# Altium schematic sheet Processor.SchDoc
size A3
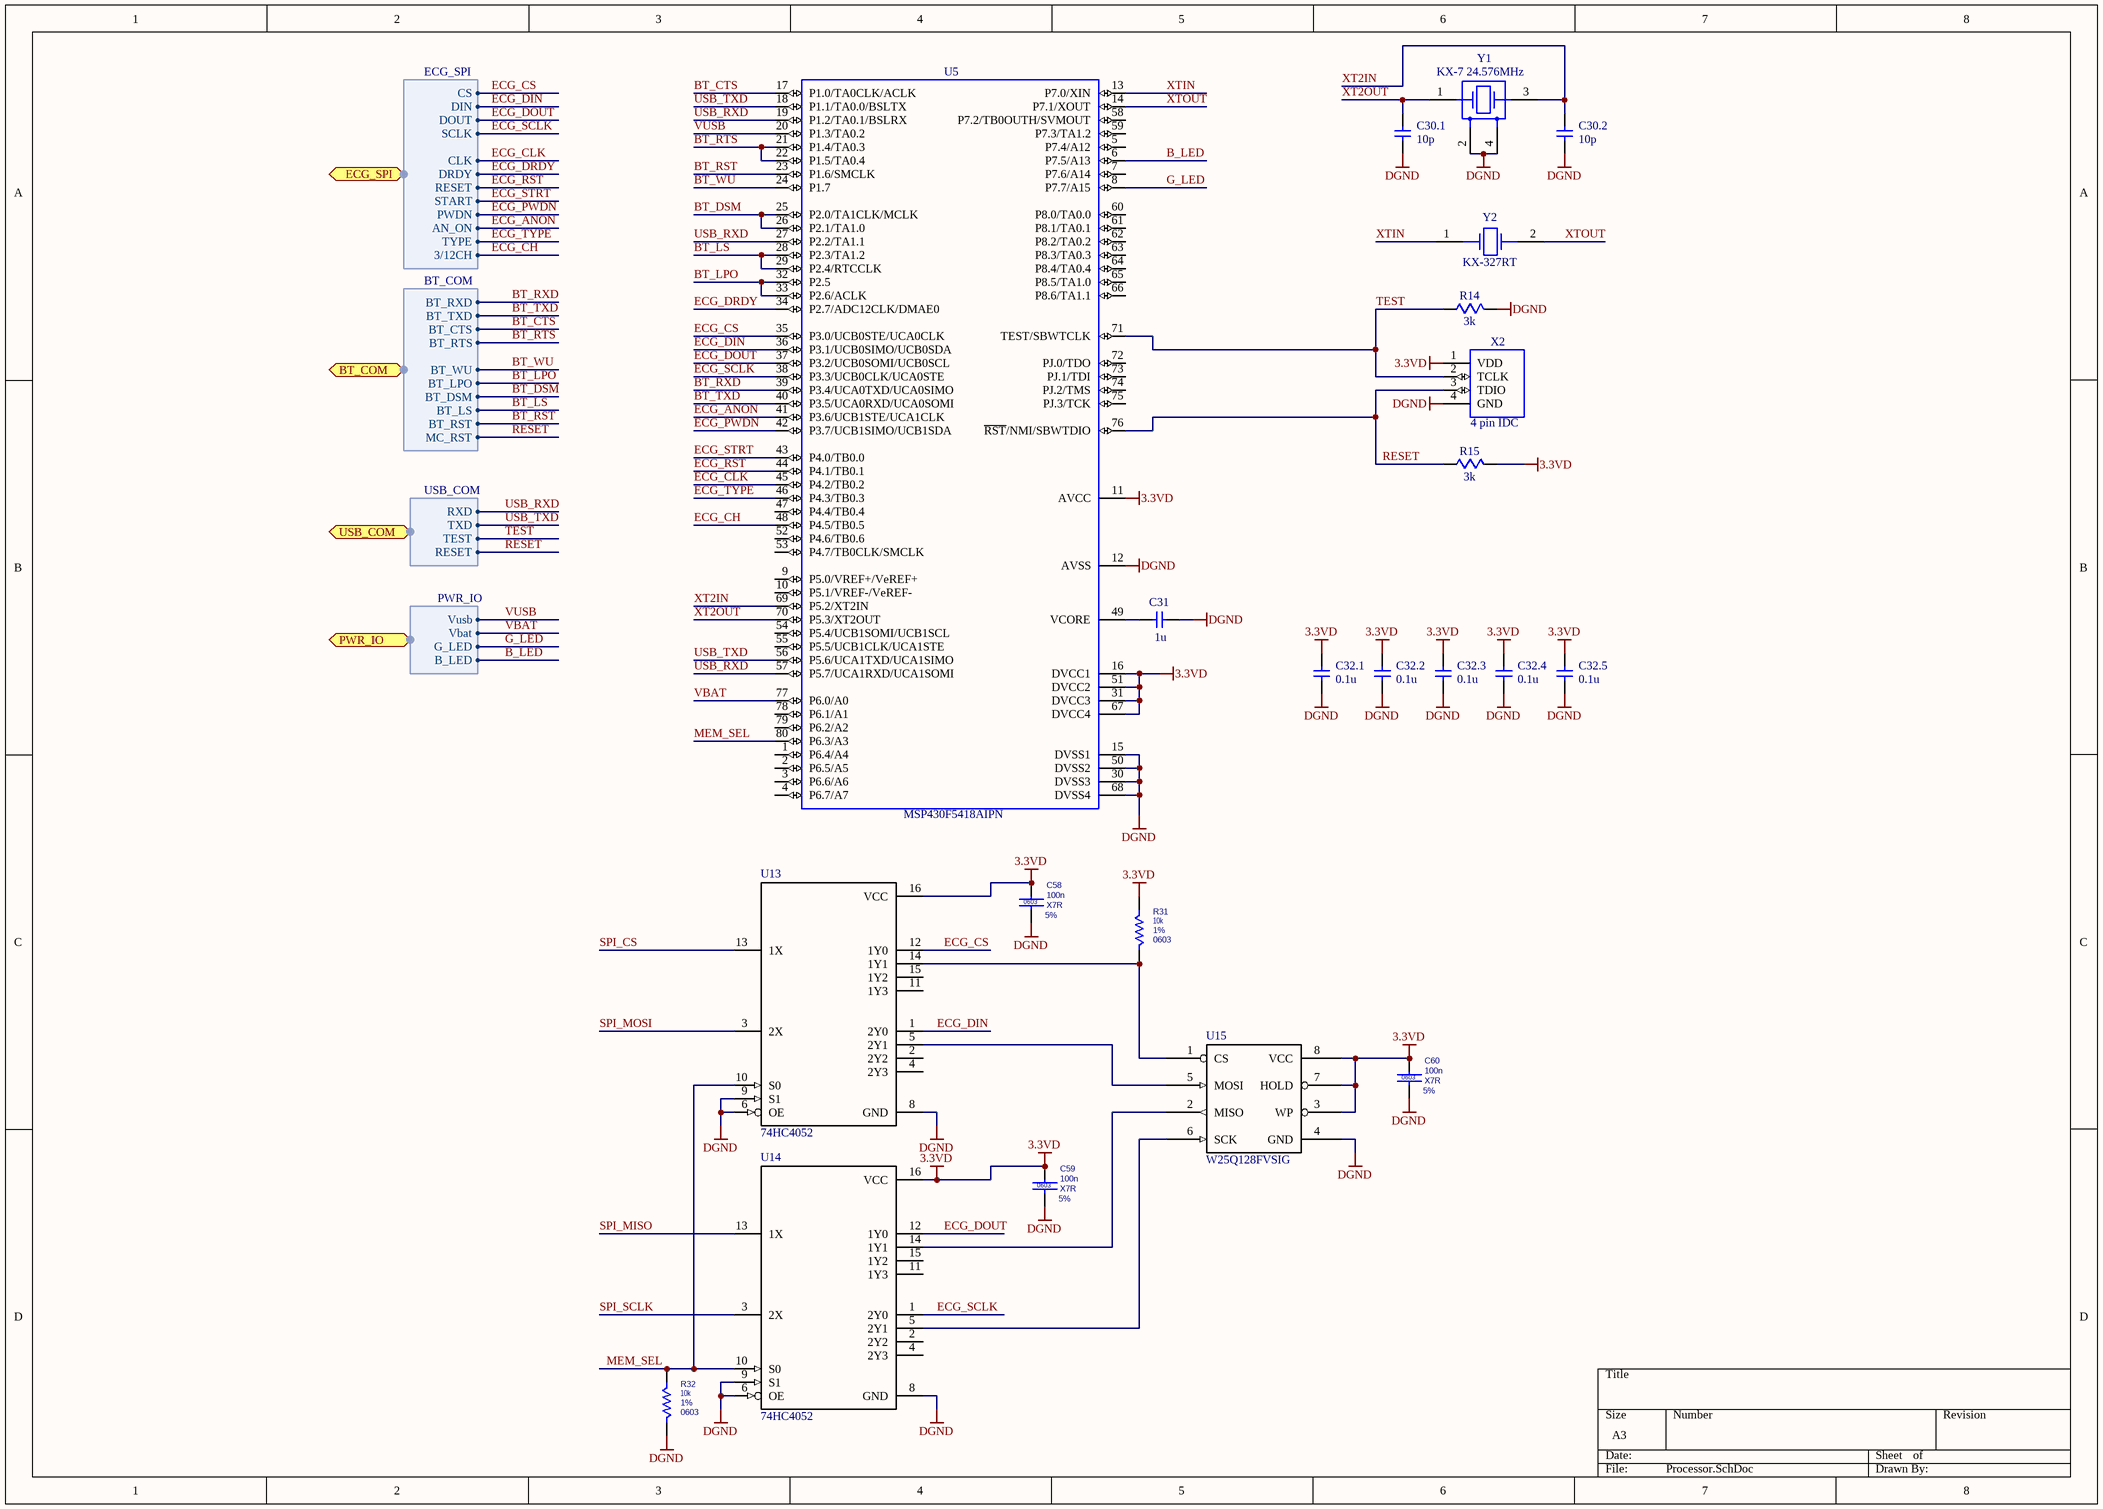
[diagram p0: Processor.SchDoc]

## Parts
C30.1  10p  [SMD/C/0603]
C30.2  10p  [SMD/C/0603]
C31  1u  [SMD/C/0603]
C32.1  0.1u  [SMD/C/0603]
C32.2  0.1u  [SMD/C/0603]
C32.3  0.1u  [SMD/C/0603]
C32.4  0.1u  [SMD/C/0603]
C32.5  0.1u  [SMD/C/0603]
C58  Tolerance: 5%  Case: 0603  Temperature Coefficient: X7R  [C0603]  (hidden comment: 100n)
C59  Tolerance: 5%  Case: 0603  Temperature Coefficient: X7R  [C0603]  (hidden comment: 100n)
C60  Tolerance: 5%  Case: 0603  Temperature Coefficient: X7R  [C0603]  (hidden comment: 100n)
R14  3k  [SMD/R/0603]
R15  3k  [SMD/R/0603]
R31  Case: 0603  Tolerance: 1%  [R0603]  (hidden comment: 10k)
R32  Case: 0603  Tolerance: 1%  [R0603]  (hidden comment: 10k)
U5  MSP430F5418AIPN  [SMD/QFP80/0.5MMP/12x12MM/14X14MMWP]
U13  74HC4052  [16-TSSOP]
U14  74HC4052  [16-TSSOP]
U15  W25Q128FVSIG
X2  4 pin IDC  [CONNECTOR/IDC/0.05P/1X4]
Y1  KX-7 24.576MHz  [KX-7]
Y2  KX-327RT  [KX–327RT]

## Ports
BT_COM (harness BT_COM), ECG_SPI (harness ECG_SPI), PWR_IO (harness PWR_IO), USB_COM (harness USB_COM)

## Harnesses
ECG_SPI: PWDN, START, DRDY, CLK, DIN, CS, DOUT, SCLK, RESET, 3/12CH, TYPE, AN_ON
BT_COM: BT_RXD, BT_TXD, BT_CTS, BT_RTS, BT_DSM, BT_WU, BT_LS, BT_RST, BT_LPO, MC_RST
USB_COM: RXD, TXD, TEST, RESET
PWR_IO: Vbat, Vusb, G_LED, B_LED

## Nets
3.3VD: C32.1.2 C32.2.2 C32.3.2 C32.4.2 C32.5.2 C58.1 C59.1 C60.1 R15.2 R31.1 U5.11(AVCC) U5.16(DVCC1) U5.31(DVCC3) U5.51(DVCC2) U5.67(DVCC4) U13.16(VCC) U14.16(VCC) U15.3(WP) U15.7(HOLD) U15.8(VCC) X2.1(VDD)
DGND: C30.1.1 C30.2.1 C31.1 C32.1.1 C32.2.1 C32.3.1 C32.4.1 C32.5.1 C58.2 C59.2 C60.2 R14.2 R32.2 U5.12(AVSS) U5.15(DVSS1) U5.30(DVSS3) U5.50(DVSS2) U5.68(DVSS4) U13.6(OE) U13.8(GND) U13.9(S1) U14.6(OE) U14.8(GND) U14.9(S1) U15.4(GND) X2.4(GND) Y1.2 Y1.4
B_LED: U5.6(P7.5/A13) ; port PWR_IO.B_LED
BT_CTS: U5.17(P1.0/TA0CLK/ACLK) ; port BT_COM.BT_CTS
BT_DSM: U5.25(P2.0/TA1CLK/MCLK) U5.26(P2.1/TA1.0) ; port BT_COM.BT_DSM
BT_LPO: U5.32(P2.5) U5.33(P2.6/ACLK) ; port BT_COM.BT_LPO
BT_LS: U5.28(P2.3/TA1.2) U5.29(P2.4/RTCCLK) ; port BT_COM.BT_LS
BT_RST: U5.23(P1.6/SMCLK) ; port BT_COM.BT_RST
BT_RTS: U5.21(P1.4/TA0.3) U5.22(P1.5/TA0.4) ; port BT_COM.BT_RTS
BT_RXD: U5.39(P3.4/UCA0TXD/UCA0SIMO) ; port BT_COM.BT_RXD
BT_TXD: U5.40(P3.5/UCA0RXD/UCA0SOMI) ; port BT_COM.BT_TXD
BT_WU: U5.24(P1.7) ; port BT_COM.BT_WU
ECG_ANON: U5.41(P3.6/UCB1STE/UCA1CLK) ; port ECG_SPI.AN_ON
ECG_CH: U5.48(P4.5/TB0.5) ; port ECG_SPI.3/12CH
ECG_CLK: U5.45(P4.2/TB0.2) ; port ECG_SPI.CLK
ECG_CS: U5.35(P3.0/UCB0STE/UCA0CLK) U13.12(1Y0) ; port ECG_SPI.CS
ECG_DIN: U5.36(P3.1/UCB0SIMO/UCB0SDA) U13.1(2Y0) ; port ECG_SPI.DIN
ECG_DOUT: U5.37(P3.2/UCB0SOMI/UCB0SCL) U14.12(1Y0) ; port ECG_SPI.DOUT
ECG_DRDY: U5.34(P2.7/ADC12CLK/DMAE0) ; port ECG_SPI.DRDY
ECG_PWDN: U5.42(P3.7/UCB1SIMO/UCB1SDA) ; port ECG_SPI.PWDN
ECG_RST: U5.44(P4.1/TB0.1) ; port ECG_SPI.RESET
ECG_SCLK: U5.38(P3.3/UCB0CLK/UCA0STE) U14.1(2Y0) ; port ECG_SPI.SCLK
ECG_STRT: U5.43(P4.0/TB0.0) ; port ECG_SPI.START
ECG_TYPE: U5.46(P4.3/TB0.3) ; port ECG_SPI.TYPE
G_LED: U5.8(P7.7/A15) ; port PWR_IO.G_LED
MEM_SEL: R32.1 U5.80(P6.3/A3) U13.10(S0) U14.10(S0)
RESET: R15.1 U5.76(~{RST}/NMI/SBWTDIO) X2.3(TDIO) ; port BT_COM.MC_RST, port USB_COM.RESET
SPI_CS: U13.13(1X)
SPI_MISO: U14.13(1X)
SPI_MOSI: U13.3(2X)
SPI_SCLK: U14.3(2X)
TEST: R14.1 U5.71(TEST/SBWTCLK) X2.2(TCLK) ; port USB_COM.TEST
USB_RXD: U5.19(P1.2/TA0.1/BSLRX) U5.27(P2.2/TA1.1) U5.57(P5.7/UCA1RXD/UCA1SOMI) ; port USB_COM.RXD
USB_TXD: U5.18(P1.1/TA0.0/BSLTX) U5.56(P5.6/UCA1TXD/UCA1SIMO) ; port USB_COM.TXD
VBAT: U5.77(P6.0/A0) ; port PWR_IO.Vbat
VUSB: U5.20(P1.3/TA0.2) ; port PWR_IO.Vusb
XT2IN: C30.2.2 U5.69(P5.2/XT2IN) Y1.3
XT2OUT: C30.1.2 U5.70(P5.3/XT2OUT) Y1.1
XTIN: U5.13(P7.0/XIN) Y2.1
XTOUT: U5.14(P7.1/XOUT) Y2.2
NetC31_2: C31.2 U5.49(VCORE)
NetR31_2: R31.2 U13.14(1Y1) U15.1(CS)
NetU13_5: U13.5(2Y1) U15.5(MOSI)
NetU14_5: U14.5(2Y1) U15.6(SCK)
NetU14_14: U14.14(1Y1) U15.2(MISO)

Not connected (* = marked no-connect by the designer): U5 1(P6.4/A4) 2(P6.5/A5) 3(P6.6/A6) 4(P6.7/A7) 5(P7.4/A12) 7(P7.6/A14) 9(P5.0/VREF+/VeREF+) 10(P5.1/VREF-/VeREF-) 47(P4.4/TB0.4) 52(P4.6/TB0.6) 53(P4.7/TB0CLK/SMCLK) 54(P5.4/UCB1SOMI/UCB1SCL) 55(P5.5/UCB1CLK/UCA1STE) 58(P7.2/TB0OUTH/SVMOUT) 59(P7.3/TA1.2) 60(P8.0/TA0.0) 61(P8.1/TA0.1) 62(P8.2/TA0.2) 63(P8.3/TA0.3) 64(P8.4/TA0.4) 65(P8.5/TA1.0) 66(P8.6/TA1.1) 72(PJ.0/TDO) 73(PJ.1/TDI) 74(PJ.2/TMS) 75(PJ.3/TCK) 78(P6.1/A1) 79(P6.2/A2); U13 2(2Y2) 4(2Y3) 11(1Y3) 15(1Y2); U14 2(2Y2) 4(2Y3) 11(1Y3) 15(1Y2)

## Library data of the parts
C30.1 C30.2 C31 C32.1-C32.5 = Capacitor
  C30.1 C30.2: Value: 10p
  C31: Value: 1u
  C32.1-C32.5: Value: 0.1u
C58-C60 = CC0603K-X7R-50V-100N: CAPACITOR; Voltage: 50V; Value: 100n; Part Number: CC0603K-X7R-50V-100N; ComponentLink2Description: Datasheet; Digikey ID: 399-7844-1-ND
R14 R15 = Resistor: Value: 3k
R31 R32 = RC0603-10K0: RES, 10K OHM, 1/10W, 1%, 0603, RoHS; Manufacturer: PHILIPS, SAMSUNG; Manufacturer Part Number: RC1608F103CS; Critical: NO; Value: 10k; Part Number: RC0603-10K0; Power: 1/10W; Temperature: -55 - +155 C; ComponentLink2Description: Datasheet; ComponentLink2URL: http://www.yageo.com/pdf/PYu-RC0603_51_RoHS_L_4.pdf; Publisher: tkondratyuk; RoHS Compliant: YES; Digikey ID: 1276-3485-1-ND
U5 = MSP430F5418AIPN: Mixed Signal Microcontroller; Value: MSP430F5418AIPN
U13 U14 = 74HC4052: IC MUX/DEMUX DUAL 4X1 16TSSOP; Manufacturer: TI; Manufacturer Part Number: CD74HC4052PWR; Part Number: 74HC4052; Stock ID: 296-17619-1-ND; Temperature: -55°C ~ 125°C; Digikey ID: 296-17619-1-ND
U15 = W25Q128: IC FLASH 128MBIT 104MHZ 8SOIC; Part Number: W25Q128; Stock ID: W25Q128FVSIG-ND; Temperature: -40°C ~ 85°C (TA); Case: SOIC8; Manufacturer Part Number: W25Q128FVSIG; Digikey ID: W25Q128FVSIG-ND
X2 = MSP430 JTAG SBW: MSP430 JTAG Connector; Value: 4 pin IDC
Y1 = KX-9A: Quartz Crystal; Value: KX-7 24.576MHz
Y2 = KX-327RT: Quartz Crystal; Value: KX-327RT